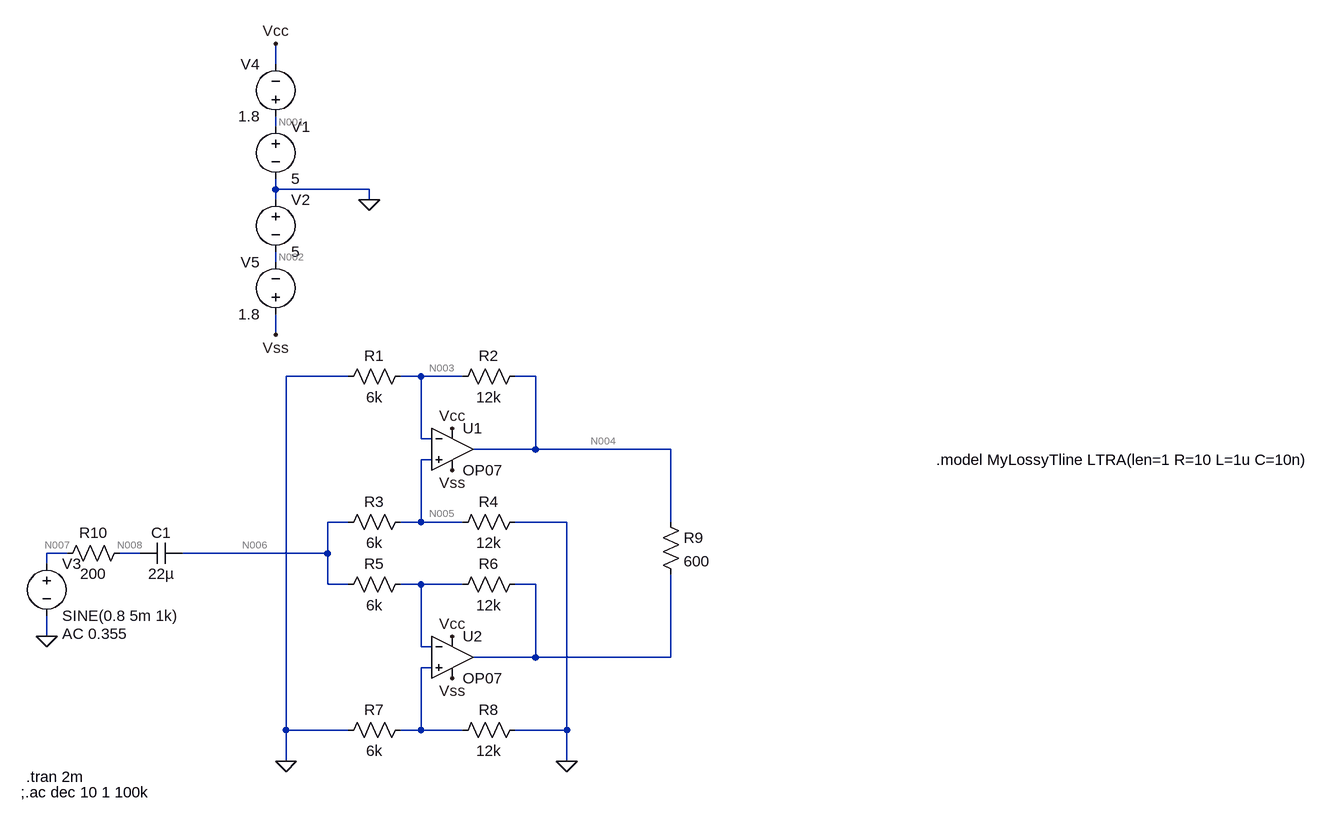
[diagram p0: schematic DiffAmp-LineDriver.asc]
DiffAmp-LineDriver.asc, the LTspice schematic file:
Version 4
SHEET 1 1588 680
WIRE -48 -464 -48 -496
WIRE -48 -368 -48 -384
WIRE -48 -272 -48 -288
WIRE 96 -272 -48 -272
WIRE -48 -256 -48 -272
WIRE 96 -256 96 -272
WIRE -48 -160 -48 -176
WIRE -48 -48 -48 -80
WIRE 64 16 -32 16
WIRE 176 16 144 16
WIRE 240 16 176 16
WIRE 352 16 320 16
WIRE 176 112 176 16
WIRE 192 112 176 112
WIRE 352 128 352 16
WIRE 352 128 256 128
WIRE 560 128 352 128
WIRE 192 144 176 144
WIRE 64 240 32 240
WIRE 176 240 176 144
WIRE 176 240 144 240
WIRE 240 240 176 240
WIRE 400 240 320 240
WIRE 560 240 560 128
WIRE -368 288 -400 288
WIRE -256 288 -288 288
WIRE 32 288 32 240
WIRE 32 288 -192 288
WIRE -400 304 -400 288
WIRE 32 336 32 288
WIRE 64 336 32 336
WIRE 176 336 144 336
WIRE 240 336 176 336
WIRE 352 336 320 336
WIRE -400 416 -400 384
WIRE 176 432 176 336
WIRE 192 432 176 432
WIRE 352 448 352 336
WIRE 352 448 256 448
WIRE 560 448 560 320
WIRE 560 448 352 448
WIRE 192 464 176 464
WIRE -32 560 -32 16
WIRE 64 560 -32 560
WIRE 176 560 176 464
WIRE 176 560 144 560
WIRE 240 560 176 560
WIRE 400 560 400 240
WIRE 400 560 320 560
WIRE -32 608 -32 560
WIRE 400 608 400 560
FLAG 96 -256 0
FLAG -48 -496 Vcc
FLAG 224 96 Vcc
FLAG -48 -48 Vss
FLAG 224 160 Vss
FLAG 224 416 Vcc
FLAG 224 480 Vss
FLAG -400 416 0
FLAG -32 608 0
FLAG 400 608 0
SYMBOL voltage -48 -384 R0
WINDOW 123 0 0 Left 0
WINDOW 39 0 0 Left 0
SYMATTR InstName V1
SYMATTR Value 5
SYMBOL voltage -48 -272 R0
WINDOW 123 0 0 Left 0
WINDOW 39 0 0 Left 0
SYMATTR InstName V2
SYMATTR Value 5
SYMBOL OpAmps\\OP07 224 64 R0
SYMATTR InstName U1
SYMBOL res 160 0 R90
WINDOW 0 0 56 VBottom 2
WINDOW 3 32 56 VTop 2
SYMATTR InstName R1
SYMATTR Value 6k
SYMBOL res 336 0 R90
WINDOW 0 0 56 VBottom 2
WINDOW 3 32 56 VTop 2
SYMATTR InstName R2
SYMATTR Value 12k
SYMBOL res 160 224 R90
WINDOW 0 0 56 VBottom 2
WINDOW 3 32 56 VTop 2
SYMATTR InstName R3
SYMATTR Value 6k
SYMBOL res 336 224 R90
WINDOW 0 0 56 VBottom 2
WINDOW 3 32 56 VTop 2
SYMATTR InstName R4
SYMATTR Value 12k
SYMBOL OpAmps\\OP07 224 384 R0
SYMATTR InstName U2
SYMBOL res 160 320 R90
WINDOW 0 0 56 VBottom 2
WINDOW 3 32 56 VTop 2
SYMATTR InstName R5
SYMATTR Value 6k
SYMBOL res 336 320 R90
WINDOW 0 0 56 VBottom 2
WINDOW 3 32 56 VTop 2
SYMATTR InstName R6
SYMATTR Value 12k
SYMBOL res 160 544 R90
WINDOW 0 0 56 VBottom 2
WINDOW 3 32 56 VTop 2
SYMATTR InstName R7
SYMATTR Value 6k
SYMBOL res 336 544 R90
WINDOW 0 0 56 VBottom 2
WINDOW 3 32 56 VTop 2
SYMATTR InstName R8
SYMATTR Value 12k
SYMBOL voltage -400 288 R0
WINDOW 123 24 124 Left 2
WINDOW 39 0 0 Left 0
SYMATTR Value2 AC 0.355
SYMATTR InstName V3
SYMATTR Value SINE(0.8 5m 1k)
SYMBOL cap -192 272 R90
WINDOW 0 0 32 VBottom 2
WINDOW 3 32 32 VTop 2
SYMATTR InstName C1
SYMATTR Value 22µ
SYMBOL res 544 224 R0
SYMATTR InstName R9
SYMATTR Value 600
SYMBOL res -272 272 R90
WINDOW 0 0 56 VBottom 2
WINDOW 3 32 56 VTop 2
SYMATTR InstName R10
SYMATTR Value 200
SYMBOL voltage -48 -368 R180
WINDOW 0 24 96 Left 2
WINDOW 3 24 16 Left 2
WINDOW 123 0 0 Left 0
WINDOW 39 0 0 Left 0
SYMATTR InstName V4
SYMATTR Value 1.8
SYMBOL voltage -48 -64 R180
WINDOW 0 24 96 Left 2
WINDOW 3 24 16 Left 2
WINDOW 123 0 0 Left 0
WINDOW 39 0 0 Left 0
SYMATTR InstName V5
SYMATTR Value 1.8
TEXT -432 632 Left 2 !.tran 2m
TEXT -440 656 Left 2 !;.ac dec 10 1 100k
TEXT 968 144 Left 2 !.model MyLossyTline LTRA(len=1 R=10 L=1u C=10n)

The netlist it stands for:
* DiffAmp-LineDriver.asc
V1 N001 0 5
V2 0 N002 5
XU1 N005 N003 Vcc Vss N004 LT1001  ; OP07, pins In+ In- V+ V- OUT
R1 N003 0 6k
R2 N004 N003 12k
R3 N005 N006 6k
R4 0 N005 12k
XU2 N011 N009 Vcc Vss N010 LT1001  ; OP07, pins In+ In- V+ V- OUT
R5 N009 N006 6k
R6 N010 N009 12k
R7 N011 0 6k
R8 0 N011 12k
V3 N007 0 SINE(0.8 5m 1k) AC 0.355
C1 N006 N008 22µ
R9 N004 N010 600
R10 N008 N007 200
V4 N001 Vcc 1.8
V5 Vss N002 1.8
.tran 2m
;.ac dec 10 1 100k
.model MyLossyTline LTRA(len=1 R=10 L=1u C=10n)
.lib LTC.lib
.backanno
.end

* Results of the author's LTspice run, read from the files saved beside the schematic
* Operating Point, zero values left out:
*   V(n001) = 5 V
*   V(n002) = -5 V
*   V(vcc) = 3.2 V
*   V(vss) = -3.2 V
*   V(n007) = 800 mV
*   V(n008) = 800 mV
*   I(V5) = 4.5 mA
*   I(V4) = 4.5 mA
*   I(V2) = -4.5 mA
*   I(V1) = -4.5 mA
*   Ix(u1:3) = 2.25 mA
*   Ix(u1:4) = -2.25 mA
*   Ix(u2:3) = 2.25 mA
*   Ix(u2:4) = -2.25 mA
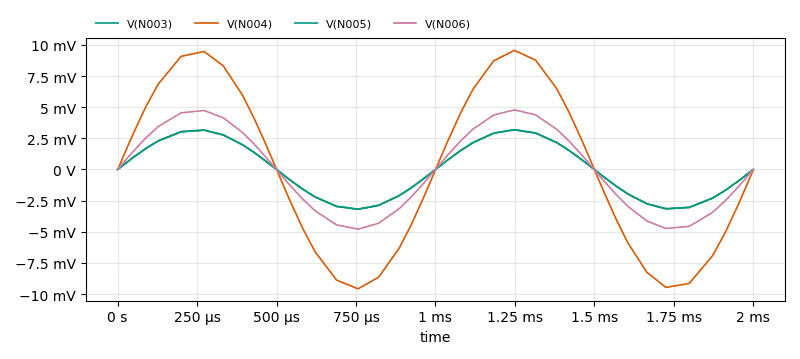
[diagram p1: Transient Analysis of DiffAmp-LineDriver.asc, plotted from the saved traces]
* Transient Analysis, 1 run:
*   V(N003): min -3.194 mV, max 3.186 mV, average -4.798 µV, rms 2.239 mV, last -12.22 µV
*   V(N004): min -9.582 mV, max 9.559 mV, average -14.39 µV, rms 6.718 mV, last -36.42 µV
*   V(N005): min -3.193 mV, max 3.186 mV, average -4.803 µV, rms 2.239 mV, last 277.6 nV
*   V(N006): min -4.79 mV, max 4.78 mV, average -7.204 µV, rms 3.359 mV, last 537.7 nV